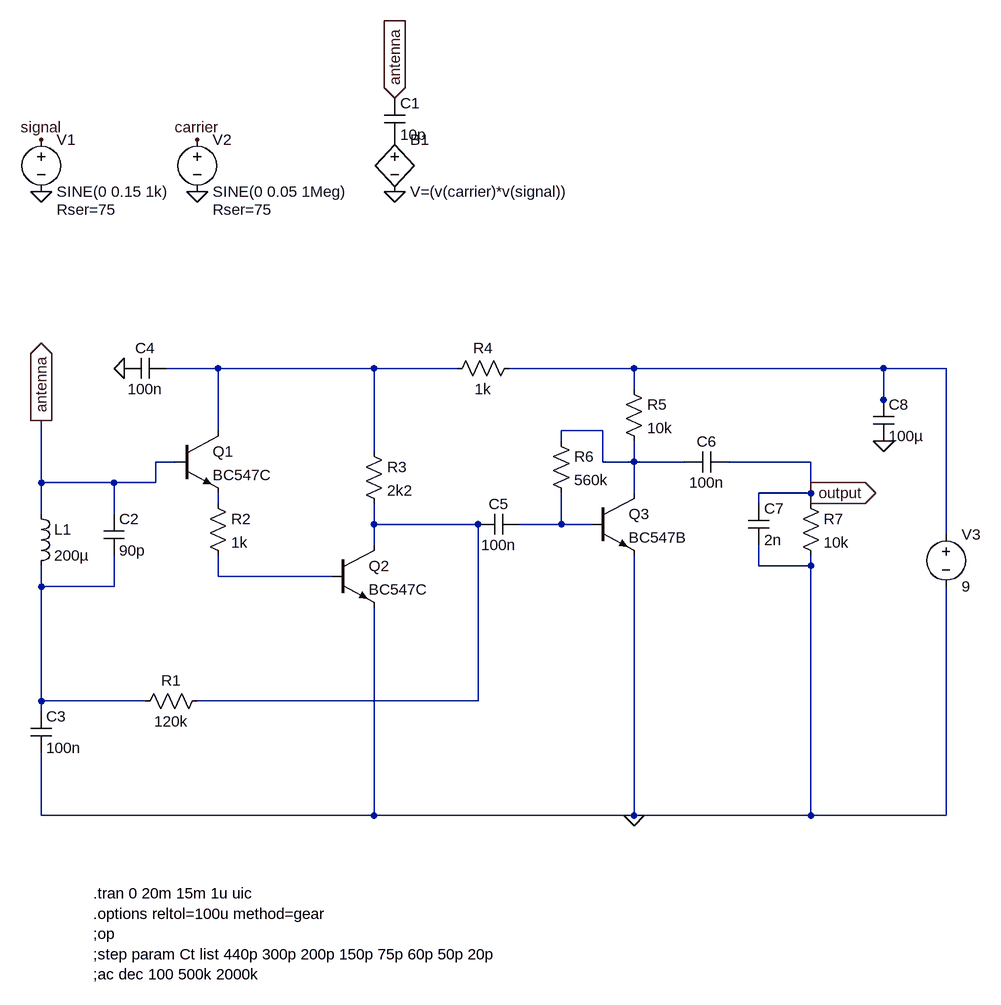
[diagram p0: schematic daddy_yankee.asc]
daddy_yankee.asc, the LTspice schematic file:
Version 4
SHEET 1 1576 1272
WIRE 400 336 320 336
WIRE 640 336 400 336
WIRE 768 336 640 336
WIRE 1040 336 848 336
WIRE 1424 336 1040 336
WIRE 1520 336 1424 336
WIRE 1040 368 1040 336
WIRE 1424 384 1424 336
WIRE 1424 400 1424 384
WIRE 400 432 400 336
WIRE 992 432 928 432
WIRE 928 448 928 432
WIRE 640 464 640 336
WIRE 336 480 304 480
WIRE 992 480 992 432
WIRE 1040 480 1040 448
WIRE 1040 480 992 480
WIRE 1120 480 1040 480
WIRE 1312 480 1184 480
WIRE 128 512 128 416
WIRE 240 512 128 512
WIRE 304 512 304 480
WIRE 304 512 240 512
WIRE 1040 528 1040 480
WIRE 1312 528 1312 480
WIRE 1312 528 1232 528
WIRE 400 544 400 528
WIRE 1232 544 1232 528
WIRE 1312 544 1312 528
WIRE 128 560 128 512
WIRE 240 560 240 512
WIRE 640 576 640 544
WIRE 800 576 640 576
WIRE 928 576 928 528
WIRE 928 576 864 576
WIRE 976 576 928 576
WIRE 1520 592 1520 336
WIRE 640 608 640 576
WIRE 1232 640 1232 608
WIRE 1312 640 1312 624
WIRE 1312 640 1232 640
WIRE 400 656 400 624
WIRE 576 656 400 656
WIRE 128 672 128 640
WIRE 240 672 240 624
WIRE 240 672 128 672
WIRE 128 848 128 672
WIRE 288 848 128 848
WIRE 800 848 800 576
WIRE 800 848 368 848
WIRE 128 864 128 848
WIRE 128 1024 128 928
WIRE 640 1024 640 704
WIRE 640 1024 128 1024
WIRE 1040 1024 1040 624
WIRE 1040 1024 640 1024
WIRE 1312 1024 1312 640
WIRE 1312 1024 1040 1024
WIRE 1520 1024 1520 672
WIRE 1520 1024 1312 1024
FLAG 128 64 0
FLAG 368 64 0
FLAG 672 64 0
FLAG 128 -16 signal
FLAG 368 -16 carrier
FLAG 672 -80 antenna
IOPIN 672 -80 In
FLAG 128 416 antenna
IOPIN 128 416 Out
FLAG 256 336 0
FLAG 1424 448 0
FLAG 1040 1024 0
FLAG 1312 528 output
IOPIN 1312 528 Out
SYMBOL voltage 128 -32 R0
WINDOW 123 0 0 Left 0
WINDOW 39 24 124 Left 2
SYMATTR SpiceLine Rser=75
SYMATTR InstName V1
SYMATTR Value SINE(0 0.15 1k)
SYMBOL voltage 368 -32 R0
WINDOW 123 0 0 Left 0
WINDOW 39 24 124 Left 2
SYMATTR SpiceLine Rser=75
SYMATTR InstName V2
SYMATTR Value SINE(0 0.05 1Meg)
SYMBOL bv 672 -32 R0
SYMATTR InstName B1
SYMATTR Value V=(v(carrier)*v(signal))
SYMBOL cap 656 -80 R0
SYMATTR InstName C1
SYMATTR Value 10p
SYMBOL ind 112 544 R0
SYMATTR InstName L1
SYMATTR Value 200µ
SYMBOL cap 224 560 R0
SYMATTR InstName C2
SYMATTR Value 90p
SYMBOL cap 112 864 R0
SYMATTR InstName C3
SYMATTR Value 100n
SYMBOL res 384 832 R90
WINDOW 0 0 56 VBottom 2
WINDOW 3 32 56 VTop 2
SYMATTR InstName R1
SYMATTR Value 120k
SYMBOL npn 336 432 R0
SYMATTR InstName Q1
SYMATTR Value BC547C
SYMBOL res 384 528 R0
SYMATTR InstName R2
SYMATTR Value 1k
SYMBOL npn 576 608 R0
SYMATTR InstName Q2
SYMATTR Value BC547C
SYMBOL cap 320 320 R90
WINDOW 0 0 32 VBottom 2
WINDOW 3 32 32 VTop 2
SYMATTR InstName C4
SYMATTR Value 100n
SYMBOL res 624 448 R0
SYMATTR InstName R3
SYMATTR Value 2k2
SYMBOL res 864 320 R90
WINDOW 0 0 56 VBottom 2
WINDOW 3 32 56 VTop 2
SYMATTR InstName R4
SYMATTR Value 1k
SYMBOL cap 864 560 R90
WINDOW 0 0 32 VBottom 2
WINDOW 3 32 32 VTop 2
SYMATTR InstName C5
SYMATTR Value 100n
SYMBOL npn 976 528 R0
SYMATTR InstName Q3
SYMATTR Value BC547B
SYMBOL res 1024 352 R0
SYMATTR InstName R5
SYMATTR Value 10k
SYMBOL res 912 432 R0
SYMATTR InstName R6
SYMATTR Value 560k
SYMBOL cap 1184 464 R90
WINDOW 0 0 32 VBottom 2
WINDOW 3 32 32 VTop 2
SYMATTR InstName C6
SYMATTR Value 100n
SYMBOL cap 1216 544 R0
SYMATTR InstName C7
SYMATTR Value 2n
SYMBOL res 1296 528 R0
SYMATTR InstName R7
SYMATTR Value 10k
SYMBOL cap 1408 384 R0
SYMATTR InstName C8
SYMATTR Value 100µ
SYMBOL voltage 1520 576 R0
WINDOW 123 0 0 Left 0
WINDOW 39 0 0 Left 0
SYMATTR InstName V3
SYMATTR Value 9
TEXT 208 1144 Left 2 !.tran 0 20m 15m 1u uic\n.options reltol=100u method=gear\n;op\n;step param Ct list 440p 300p 200p 150p 75p 60p 50p 20p\n;ac dec 100 500k 2000k

The netlist it stands for:
* daddy_yankee.asc
V1 signal 0 SINE(0 0.15 1k) Rser=75
V2 carrier 0 SINE(0 0.05 1Meg) Rser=75
B1 P001 0 V=(v(carrier)*v(signal))
C1 antenna P001 10p
L1 antenna N008 200µ
C2 antenna N008 90p
C3 N008 0 100n
R1 N005 N008 120k
Q1 N001 antenna N004 0 BC547C
R2 N004 N007 1k
Q2 N005 N007 0 0 BC547C
C4 N001 0 100n
R3 N001 N005 2k2
R4 N002 N001 1k
C5 N006 N005 100n
Q3 N003 N006 0 0 BC547B
R5 N002 N003 10k
R6 N003 N006 560k
C6 output N003 100n
C7 output 0 2n
R7 output 0 10k
C8 N002 0 100µ
V3 N002 0 9
.model NPN NPN
.model PNP PNP
.lib standard.bjt
.tran 0 20m 15m 1u uic
.options reltol=100u method=gear
;op
;step param Ct list 440p 300p 200p 150p 75p 60p 50p 20p
;ac dec 100 500k 2000k
.backanno
.end